# Altium schematic sheet atmega.SchDoc
size A4
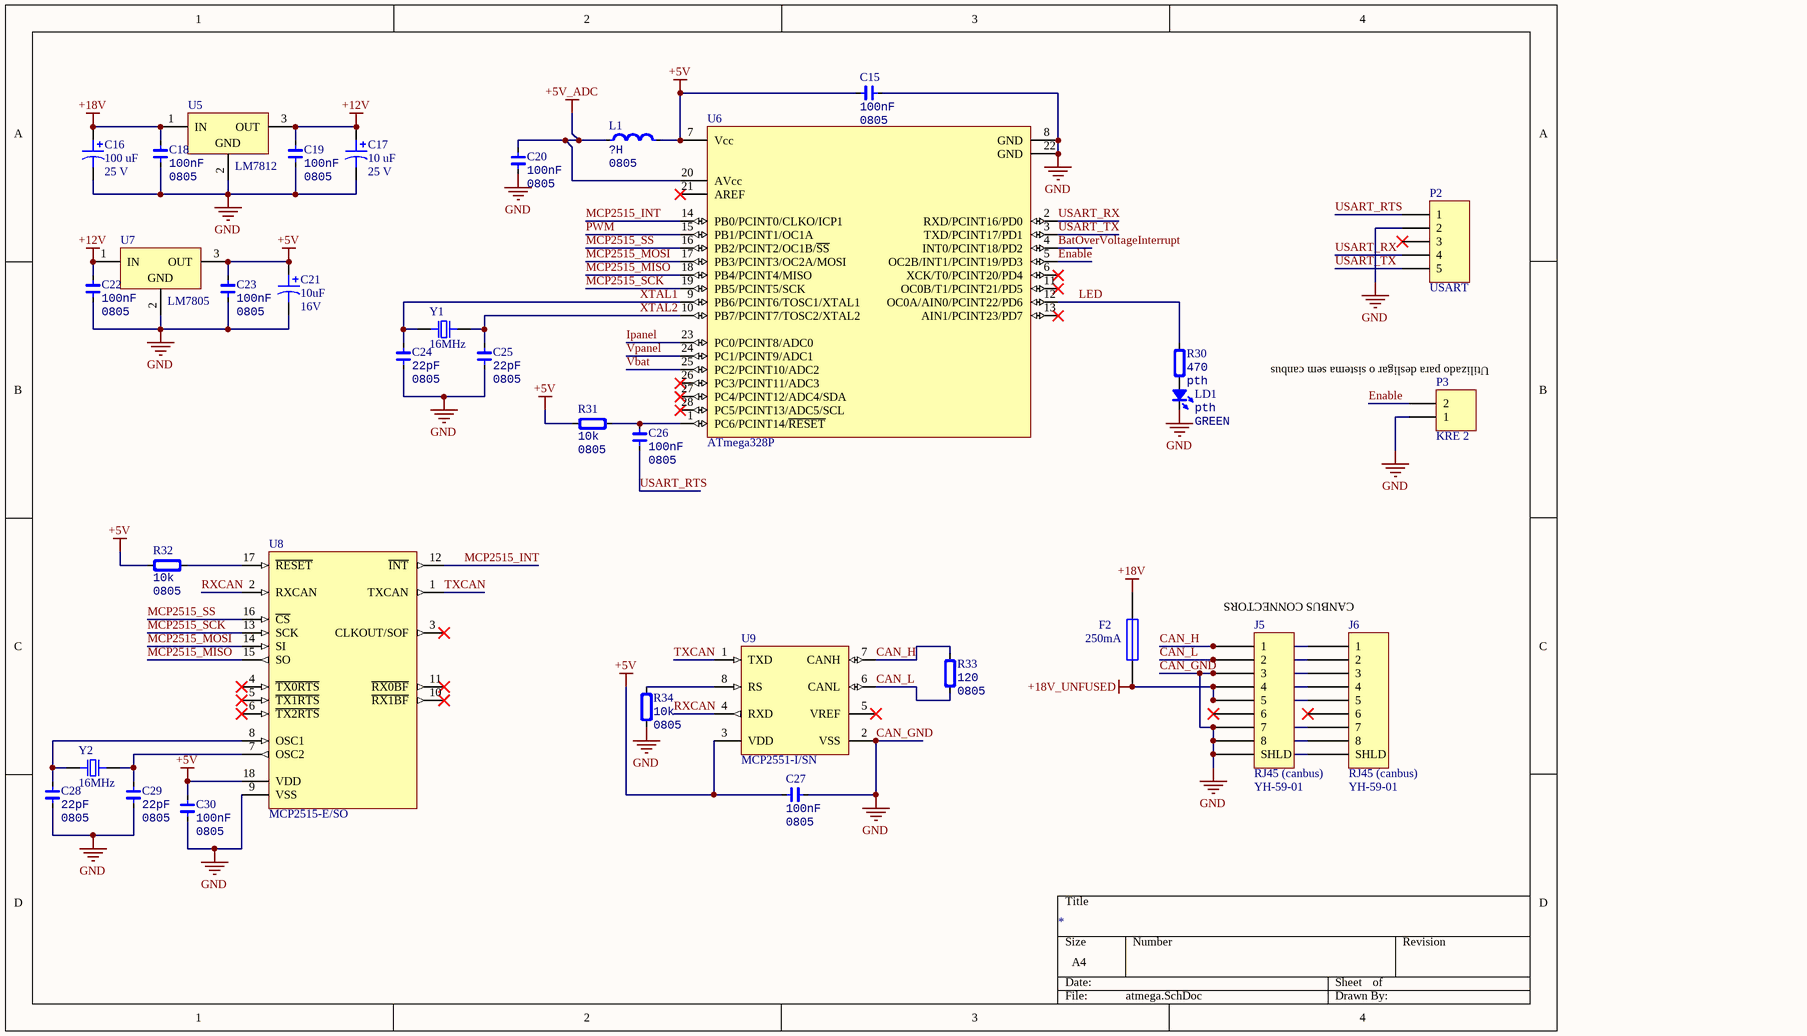
[diagram p0: atmega.SchDoc]

## Parts
C15  Type: 0805  [0805C]  (hidden comment: 100nF)
C16  value 100 uF  Voltage: 25 V  [cap10uF16V]  (hidden comment: CapacitorPol)
C17  value 10 uF  Voltage: 25 V  [cap10uF16V]  (hidden comment: CapacitorPol)
C18  Type: 0805  [0805C]  (hidden comment: 100nF)
C19  Type: 0805  [0805C]  (hidden comment: 100nF)
C20  Type: 0805  [0805C]  (hidden comment: 100nF)
C21  value 10uF  Voltage: 16V  [cap10uF16V]  (hidden comment: CapacitorPol)
C22  Type: 0805  [0805C]  (hidden comment: 100nF)
C23  Type: 0805  [0805C]  (hidden comment: 100nF)
C24  Type: 0805  [0805C]  (hidden comment: 22pF)
C25  Type: 0805  [0805C]  (hidden comment: 22pF)
C26  Type: 0805  [0805C]  (hidden comment: 100nF)
C27  Type: 0805  [0805C]  (hidden comment: 100nF)
C28  Type: 0805  [0805C]  (hidden comment: 22pF)
C29  Type: 0805  [0805C]  (hidden comment: 22pF)
C30  Type: 0805  [0805C]  (hidden comment: 100nF)
F2  250mA  [Porta Fusivel]
J5  RJ45 (canbus)  value YH-59-01  [ASSMANN A-2004-2-4-LP/FS]
J6  RJ45 (canbus)  value YH-59-01  [ASSMANN A-2004-2-4-LP/FS]
L1  Type: 0805  [0805L]  (hidden comment: ?H)
LD1  Type: pth  [LED3MM]  (hidden comment: GREEN)
P2  USART  [HDR1X5]
P3  KRE 2  [KRE_2]
R30  Type: pth  [AXIAL-0.3]  (hidden comment: 470)
R31  Type: 0805  [0805R]  (hidden comment: 10k)
R32  Type: 0805  [0805R]  (hidden comment: 10k)
R33  Type: 0805  [0805R]  (hidden comment: 120)
R34  Type: 0805  [0805R]  (hidden comment: 10k)
U5  LM7812  [TO220_deitado]
U6  ATmega328P  [DIP28-300(100)]
U7  LM7805  [TO220_deitado]
U8  MCP2515-E/SO  [WSO18_L]
U9  MCP2551-I/SN  [SOIC08-150(50)]
Y1  16MHz  [HC49-US-THT]
Y2  16MHz  [HC49-US-THT]

## Nets
+5V: C15.1 C21.1 C23.2 C27.1 C30.1 L1.2 R31.1 R32.1 U6.7(Vcc) U7.3(OUT) U8.18(VDD) U9.3(VDD)
+5V_ADC: C20.2 L1.1 U6.20(AVcc)
+12V: C17.1 C19.2 C22.2 U5.3(OUT) U7.1(IN)
+18V: C16.1 C18.2 F2.1 U5.1(IN)
+18V_UNFUSED: F2.2 J5.4 J5.5 J6.4 J6.5
CAN_GND: C15.2 C16.2 C17.2 C18.1 C19.1 C20.1 C21.2 C22.1 C23.1 C24.1 C25.1 C27.2 C28.1 C29.1 C30.2 J5.3 J5.7 J5.8 J5.S(SHLD) J6.3 J6.7 J6.8 J6.S(SHLD) LD1.2(K) P2.2 P3.1 R34.2 U5.2(GND) U6.8(GND) U6.22(GND) U7.2(GND) U8.9(VSS) U9.2(VSS)  [also labelled GND]
BatOverVoltageInterrupt: U6.4(INT0/PCINT18/PD2)
CAN_H: J5.1 J6.1 R33.2 U9.7(CANH)
CAN_L: J5.2 J6.2 R33.1 U9.6(CANL)
Enable: P3.2 U6.5(OC2B/INT1/PCINT19/PD3)
Ipanel: U6.23(PC0/PCINT8/ADC0)
LED: R30.2 U6.12(OC0A/AIN0/PCINT22/PD6)
MCP2515_INT: U6.14(PB0/PCINT0/CLKO/ICP1) U8.12(~{INT})
MCP2515_MISO: U6.18(PB4/PCINT4/MISO) U8.15(SO)
MCP2515_MOSI: U6.17(PB3/PCINT3/OC2A/MOSI) U8.14(SI)
MCP2515_SCK: U6.19(PB5/PCINT5/SCK) U8.13(SCK)
MCP2515_SS: U6.16(PB2/PCINT2/OC1B/~{SS}) U8.16(~{CS})
PWM: U6.15(PB1/PCINT1/OC1A)
RXCAN: U8.2(RXCAN) U9.4(RXD)
TXCAN: U8.1(TXCAN) U9.1(TXD)
USART_RTS: C26.2 P2.1
USART_RX: P2.4 U6.2(RXD/PCINT16/PD0)
USART_TX: P2.5 U6.3(TXD/PCINT17/PD1)
Vbat: U6.25(PC2/PCINT10/ADC2)
Vpanel: U6.24(PC1/PCINT9/ADC1)
XTAL1: C24.2 U6.9(PB6/PCINT6/TOSC1/XTAL1) Y1.1
XTAL2: C25.2 U6.10(PB7/PCINT7/TOSC2/XTAL2) Y1.2
NetC26_1: C26.1 R31.2 U6.1(PC6/PCINT14/~{RESET})
NetC28_2: C28.2 U8.8(OSC1) Y2.1
NetC29_2: C29.2 U8.7(OSC2) Y2.2
NetLD1_1: LD1.1(A) R30.1
NetR32_2: R32.2 U8.17(~{RESET})
NetR34_1: R34.1 U9.8(RS)

Not connected (* = marked no-connect by the designer): J5 6*; J6 6*; P2 3*; U6 6(XCK/T0/PCINT20/PD4)* 11(OC0B/T1/PCINT21/PD5)* 13(AIN1/PCINT23/PD7)* 21(AREF)* 26(PC3/PCINT11/ADC3)* 27(PC4/PCINT12/ADC4/SDA)* 28(PC5/PCINT13/ADC5/SCL)*; U8 3(CLKOUT/SOF)* 4(~{TX0RTS})* 5(~{TX1RTS})* 6(~{TX2RTS})* 10(~{RX1BF})* 11(~{RX0BF})*; U9 5(VREF)*

## Notes on the sheet
- Utilizado para desligar o sistema sem canbus
- CANBUS CONNECTORS

## Library data of the parts
C15 C18-C20 C22-C30 = Cap_0805: Capacitor
  C15 C18-C20 C22 C23 C26 C27 C30: Value: 100nF
  C24 C25 C28 C29: Value: 22pF
C16 C17 C21 = CapacitorPol: Solid Aluminum Capacitor with Organic Semiconductor Electrolyte: 100uF, 10V, Bulk Pack; Type: pth
F2 = Fuse 1: Fuse; Type: 5x20; Value: 250mA
J5 J6 = Modular Jack with Shield: YH-59-01; Type: RJ45
L1 = Ind_0805: Inductor; Value: ?H
LD1 = LED_0805: LED; Value: GREEN
P2 = Header 5: Header, 5-Pin; Type: header
P3 = KRE_2: Terminal Block 1x2; Type: KRE; Value: KRE 2
R30-R34 = Res_0805: Resistor
  R30: Value: 470
  R31 R32 R34: Value: 10k
  R33: Value: 120
U5 U7 = µA7805CKC: Positive-Voltage Regulator; Type: smd
U6 = ATmega328P: 8-bit AVR Microcontroller, 32KB Flash, 1KB EEPROM, 2KB SRAM, 28-pin PDIP, Industrial Grade (-40°C to 85°C); Type: smd
U8 = CMP-0186-00035-2: Stand-Alone CAN Controller With SPI Interface, 18-Pin SOIC, Extended Temperature; Type: smd
U9 = CMP-1721-00003-1: High-Speed CAN Transceiver, / 1 Mb/s, 4.5 to 5.5 V, 8-Pin SOIC (SN), Industrial Temperature, RoHS, Tube; Type: smd
Y1 Y2 = Crystal: Type: pth